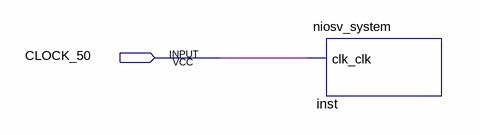
[diagram p0: schematic sheet]
// Quartus schematic niosv_top.bdf as structural Verilog: 1 symbols, 1 pins
module niosv_top (
  input  CLOCK_50
);

  niosv_system inst (.clk_clk(CLOCK_50));
endmodule
